# Altium schematic sheet [2]MCU.SchDoc
size A4
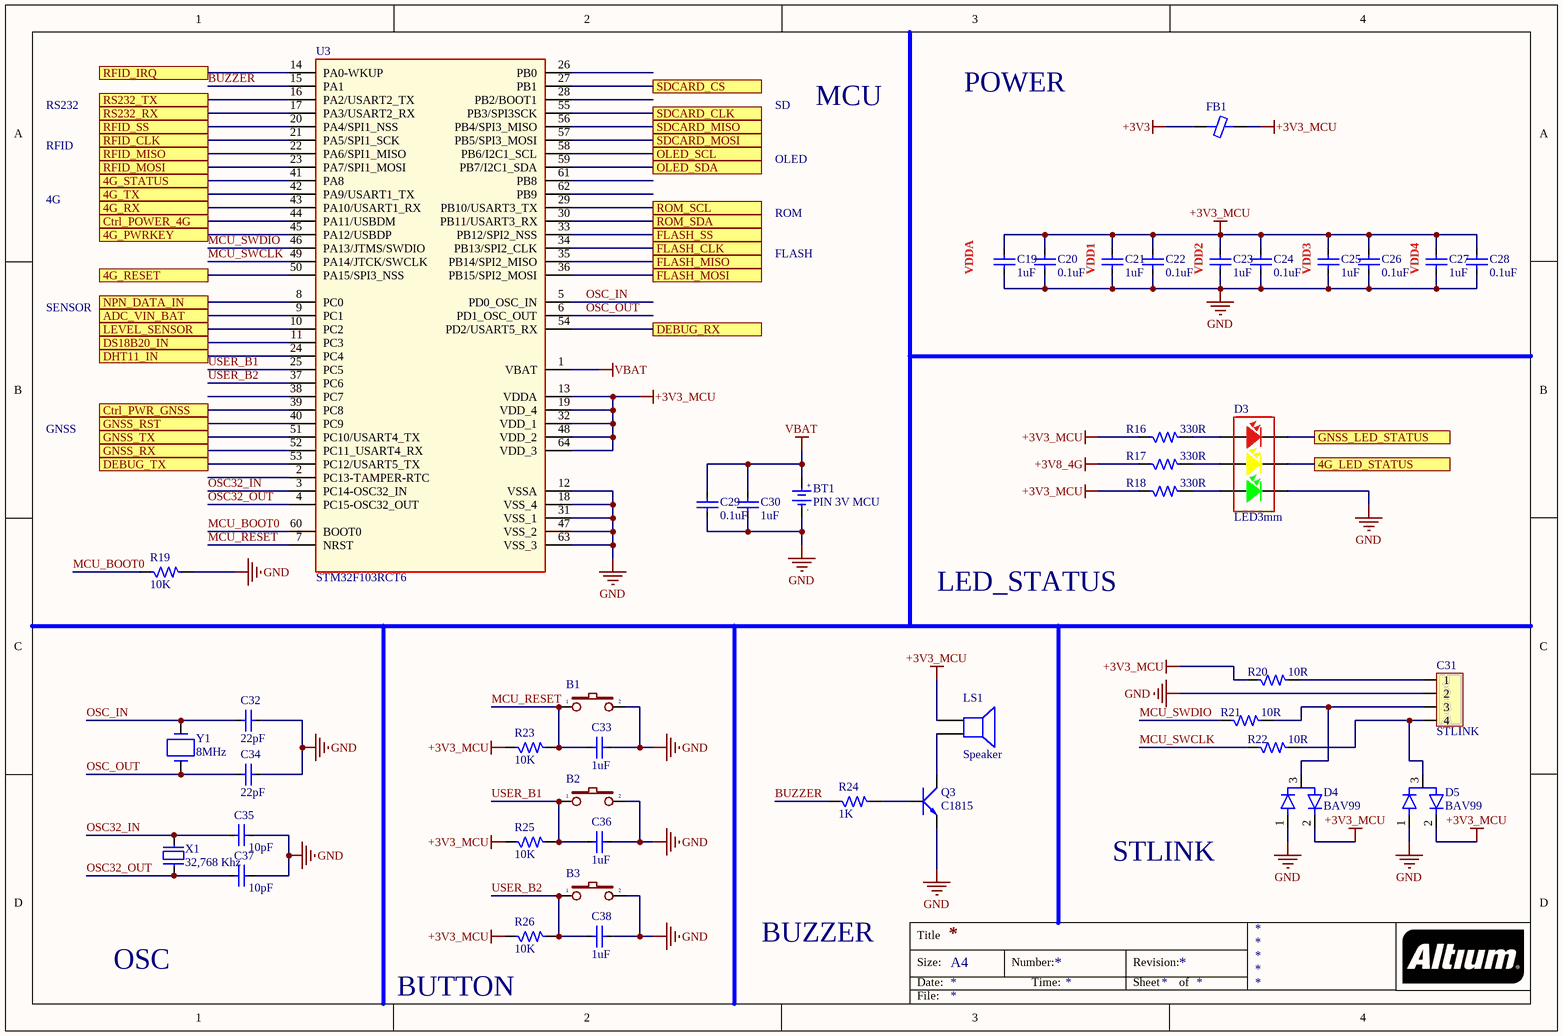
[diagram p0: [2]MCU.SchDoc]

## Parts
B1  Button 3x4x2.5  [Button 3x4x2.5]  (value not drawn)
B2  Button 3x4x2.5  [Button 3x4x2.5]  (value not drawn)
B3  Button 3x4x2.5  [Button 3x4x2.5]  (value not drawn)
BT1  PIN 3V MCU  [CR1220 SMD]
C19  1uF  [CAP_0805]
C20  0.1uF  [CAP_0805]
C21  1uF  [CAP_0805]
C22  0.1uF  [CAP_0805]
C23  1uF  [CAP_0805]
C24  0.1uF  [CAP_0805]
C25  1uF  [CAP_0805]
C26  0.1uF  [CAP_0805]
C27  1uF  [CAP_0805]
C28  0.1uF  [CAP_0805]
C29  0.1uF  [CAP_0805]
C30  1uF  [CAP_0805]
C31  STLINK  [CON_4P]
C32  22pF  [CAP_0805]
C33  1uF  [CAP_0805]
C34  22pF  [CAP_0805]
C35  10pF  [CAP_0805]
C36  1uF  [CAP_0805]
C37  10pF  [CAP_0805]
C38  1uF  [CAP_0805]
D3  LED3mm  [LED 3 holder 3mm]
D4  BAV99  [DIO_BAV99]
D5  BAV99  [DIO_BAV99]
FB1  120R  [RES-SMD-0805]  (value not drawn)
LS1  Speaker  [SPEAKER]
Q3  C1815  [SOT23B]
R16  330R  [R0805]
R17  330R  [R0805]
R18  330R  [R0805]
R19  10K  [R0805]
R20  10R  [R0805]
R21  10R  [R0805]
R22  10R  [R0805]
R23  10K  [R0805]
R24  1K  [R0805]
R25  10K  [R0805]
R26  10K  [R0805]
U3  STM32F103RCT6  [LQFP-64]
X1  32,768 Khz  [XT32kn]
Y1  8MHz  [ABM7_v1_1_BIG]

## Ports
4G_LED_STATUS, 4G_PWRKEY, 4G_RESET, 4G_RX, 4G_STATUS, 4G_TX, ADC_VIN_BAT, Ctrl_POWER_4G, Ctrl_PWR_GNSS, DEBUG_RX, DEBUG_TX, DHT11_IN, DS18B20_IN, FLASH_CLK, FLASH_MISO, FLASH_MOSI, FLASH_SS, GNSS_LED_STATUS, GNSS_RST, GNSS_RX, GNSS_TX, LEVEL_SENSOR, NPN_DATA_IN, OLED_SCL, OLED_SDA, RFID_CLK, RFID_IRQ, RFID_MISO, RFID_MOSI, RFID_SS, ROM_SCL, ROM_SDA, RS232_RX, RS232_TX, SDCARD_CLK, SDCARD_CS, SDCARD_MISO, SDCARD_MOSI

## Nets
+3V3: FB1.1
+3V3_MCU: C19.2 C20.2 C21.2 C22.2 C23.2 C24.2 C25.2 C26.2 C27.2 C28.2 D4.2 D5.2 FB1.2 LS1.1 R16.1 R18.1 R20.1 R23.1 R25.1 R26.1 U3.13(VDDA) U3.19(VDD_4) U3.32(VDD_1) U3.48(VDD_2) U3.64(VDD_3)
+3V8_4G: R17.1
GND: B1.2 B2.2 B3.2 BT1.2(GND) C19.1 C20.1 C21.1 C22.1 C23.1 C24.1 C25.1 C26.1 C27.1 C28.1 C29.1 C30.1 C31.2 C32.1 C33.1 C34.1 C35.1 C36.1 C37.1 C38.1 D3.5 D4.1 D5.1 Q3.1(E) R19.2 U3.12(VSSA) U3.18(VSS_4) U3.31(VSS_1) U3.47(VSS_2) U3.63(VSS_3)
VBAT: BT1.1(+3V) C29.2 C30.2 U3.1(VBAT)
4G_LED_STATUS: D3.3 ; port 4G_LED_STATUS
4G_PWRKEY: U3.45(PA12/USBDP) ; port 4G_PWRKEY
4G_RESET: U3.50(PA15/SPI3_NSS) ; port 4G_RESET
4G_RX: U3.43(PA10/USART1_RX) ; port 4G_RX
4G_STATUS: U3.41(PA8) ; port 4G_STATUS
4G_TX: U3.42(PA9/USART1_TX) ; port 4G_TX
ADC_VIN_BAT: U3.9(PC1) ; port ADC_VIN_BAT
BUZZER: R24.1 U3.15(PA1)
Ctrl_POWER_4G: U3.44(PA11/USBDM) ; port Ctrl_POWER_4G
Ctrl_PWR_GNSS: U3.39(PC8) ; port Ctrl_PWR_GNSS
DEBUG_RX: U3.54(PD2/USART5_RX) ; port DEBUG_RX
DEBUG_TX: U3.53(PC12/USART5_TX) ; port DEBUG_TX
DHT11_IN: U3.24(PC4) ; port DHT11_IN
DS18B20_IN: U3.11(PC3) ; port DS18B20_IN
FLASH_CLK: U3.34(PB13/SPI2_CLK) ; port FLASH_CLK
FLASH_MISO: U3.35(PB14/SPI2_MISO) ; port FLASH_MISO
FLASH_MOSI: U3.36(PB15/SPI2_MOSI) ; port FLASH_MOSI
FLASH_SS: U3.33(PB12/SPI2_NSS) ; port FLASH_SS
GNSS_LED_STATUS: D3.1 ; port GNSS_LED_STATUS
GNSS_RST: U3.40(PC9) ; port GNSS_RST
GNSS_RX: U3.52(PC11_USART4_RX) ; port GNSS_RX
GNSS_TX: U3.51(PC10/USART4_TX) ; port GNSS_TX
LEVEL_SENSOR: U3.10(PC2) ; port LEVEL_SENSOR
MCU_BOOT0: R19.1 U3.60(BOOT0)
MCU_RESET: B1.1 C33.2 R23.2 U3.7(NRST)
MCU_SWCLK: R22.1 U3.49(PA14/JTCK/SWCLK)
MCU_SWDIO: R21.1 U3.46(PA13/JTMS/SWDIO)
NPN_DATA_IN: U3.8(PC0) ; port NPN_DATA_IN
OLED_SCL: U3.58(PB6/I2C1_SCL) ; port OLED_SCL
OLED_SDA: U3.59(PB7/I2C1_SDA) ; port OLED_SDA
OSC32_IN: C35.2 U3.3(PC14-OSC32_IN) X1.1
OSC32_OUT: C37.2 U3.4(PC15-OSC32_OUT) X1.2
OSC_IN: C32.2 U3.5(PD0_OSC_IN) Y1.2
OSC_OUT: C34.2 U3.6(PD1_OSC_OUT) Y1.1
RFID_CLK: U3.21(PA5/SPI1_SCK) ; port RFID_CLK
RFID_IRQ: U3.14(PA0-WKUP) ; port RFID_IRQ
RFID_MISO: U3.22(PA6/SPI1_MISO) ; port RFID_MISO
RFID_MOSI: U3.23(PA7/SPI1_MOSI) ; port RFID_MOSI
RFID_SS: U3.20(PA4/SPI1_NSS) ; port RFID_SS
ROM_SCL: U3.29(PB10/USART3_TX) ; port ROM_SCL
ROM_SDA: U3.30(PB11/USART3_RX) ; port ROM_SDA
RS232_RX: U3.17(PA3/USART2_RX) ; port RS232_RX
RS232_TX: U3.16(PA2/USART2_TX) ; port RS232_TX
SDCARD_CLK: U3.55(PB3/SPI3SCK) ; port SDCARD_CLK
SDCARD_CS: U3.27(PB1) ; port SDCARD_CS
SDCARD_MISO: U3.56(PB4/SPI3_MISO) ; port SDCARD_MISO
SDCARD_MOSI: U3.57(PB5/SPI3_MOSI) ; port SDCARD_MOSI
USER_B1: B2.1 C36.2 R25.2 U3.25(PC5)
USER_B2: B3.1 C38.2 R26.2 U3.37(PC6)
NetC31_1: C31.1 R20.2
NetC31_3: C31.3 D4.3 R21.2
NetC31_4: C31.4 D5.3 R22.2
NetD3_2: D3.2 R16.2
NetD3_4: D3.4 R17.2
NetD3_6: D3.6 R18.2
NetLS1_2: LS1.2 Q3.2(C)
NetQ3_3: Q3.3(B) R24.2

Not connected (* = marked no-connect by the designer): U3 2(PC13-TAMPER-RTC) 26(PB0) 28(PB2/BOOT1) 38(PC7) 61(PB8) 62(PB9)

## Notes on the sheet
- RS232
- SD
- MCU
- POWER
- RFID
- OLED
- 4G
- ROM
- SENSOR
- FLASH
- (near C19) VDDA
- (near C21) VDD1
- (near C23) VDD2
- (near C25) VDD3
- (near C27) VDD4
- GNSS
- LED_STATUS
- STLINK
- OSC
- BUZZER
- (near R26) BUTTON
- Title
- Size:
- Date:
- A4
- Number:
- Time:
- Revision:
- Sheet
- of
- File:
- (in symbol PIN 3V) +; -

## Library data of the parts
B1-B3 = Button 3x4x2.5: pin to pad: 1>15 2>19
BT1 = PIN 3V: Battery 3VDC; Value: PIN 3V
C19-C30 C32-C38 = CapSMD: Capacitor; Value: 33p; Published: 8-Jun-2000; LatestRevisionDate: 17-Jul-2002; LatestRevisionNote: Re-released for DXP Platform.; PackageReference: RAD-0.3; Publisher: Altium Limited
C31 = Header4: Header IDC, 4 x 1 Pin Vertical 2.54mm Pitch (Non-Boxed, Male); Manufacturer: W¨¹rth Elektronik eiSos GmbH; partNo: 613002143121; ComponentLink1 Description: Manufacturer; ComponentLink2 Description: Datasheet; NoPins: 02; Created Date: 29 March 2013; ComponentLink1URL: http://www.we-online.com; ComponentLink2URL: http://katalog.we-online.de/em/datasheet/6130xx143121.pdf; Created by: Karrer Zheng
D3 = LED3Holder_3: LED 3 holder RGB 3mm; Value: LED 3 ly Single Colour
D4 D5 = BAV99: Diode Array 1 Pair Series Connection Standard 100V 215mA (DC) Surface Mount TO-236-3, SC-59, SOT-23-3; MF: ON Semiconductor; Price: None; Availability: In Stock; MP: BAV99; Package: SOT-23-3 Motorola; SnapEDA_Link: https://www.snapeda.com/parts/BAV99/Onsemi/view-part/?ref=snap; Check_prices: https://www.snapeda.com/parts/BAV99/Onsemi/view-part/?ref=eda; Value: *; Purchase-URL: https://pricing.snapeda.com/search/part/BAV99/?ref=eda
FB1 = Ferrite beads
LS1 = Speaker: Loudspeaker; Published: 24-Mar-1999; LatestRevisionDate: 17-Jul-2002; LatestRevisionNote: Re-released for DXP Platform.; PackageReference: PIN2; Publisher: Altium Limited
Q3 = C1815: NPN 600mW, ECB; Value: C1815
R16-R23 R25 R26 = RM: Resistor SMD; Value: 1K
R24 = RM: Resistor SMD; Value: 1K
U3 = STM32F103RCT6: MCU 32BIT 256KB FLASH 64LQFP
X1 = XT32k: Crystal 32,768kHz for timer real; Value: 32,768khz
Y1 = ABM7-16.000MHZ-D2Y-T: CRYSTAL 16MHZ 18PF SMD; Manufacturer: Abracon LLC; Frequency Stability: ±30ppm; Frequency Tolerance: ±20ppm; ESR (Equivalent Series Resistance): 50 Ohm; Operating Mode: Fundamental; .Creator: MM; .Checked PCB: RF; Supplier 1: Digi-Key; Manufacturer Part Number: ABM7-16.000MHZ-D2Y-T; RoHS: RoHS Compliant; Category: Crystals and Oscillators; Stock 1: 5861; Pricing 1: 1=0.96, 10=0.847, 50=0.791, 100=0.7, 500=0.6615 (USD); Packaging: Cut Tape (CT); Type: MHz Crystal; Frequency: 16MHz; Load Capacitance: 18pF; Operating Temperature: -40°C ~ 85°C; Ratings: -; Mounting Type: Surface Mount; Package / Case: 2-SMD; Size / Dimension: 0.236" L x 0.138" W (6.00mm x 3.50mm); Height: 0.055" (1.40mm); ComponentLink1URL: http://www.abracon.com/Resonators/abm7.pdf; ComponentLink1Description: http://www.abracon.com/Resonators/abm7.pdf; Supplier Part Number 1: 535-9840-1-ND; .Checked SCH: RF